# EAGLE design Z80-Clock-And-Reset-1-1 (EAGLE 9.6.2)
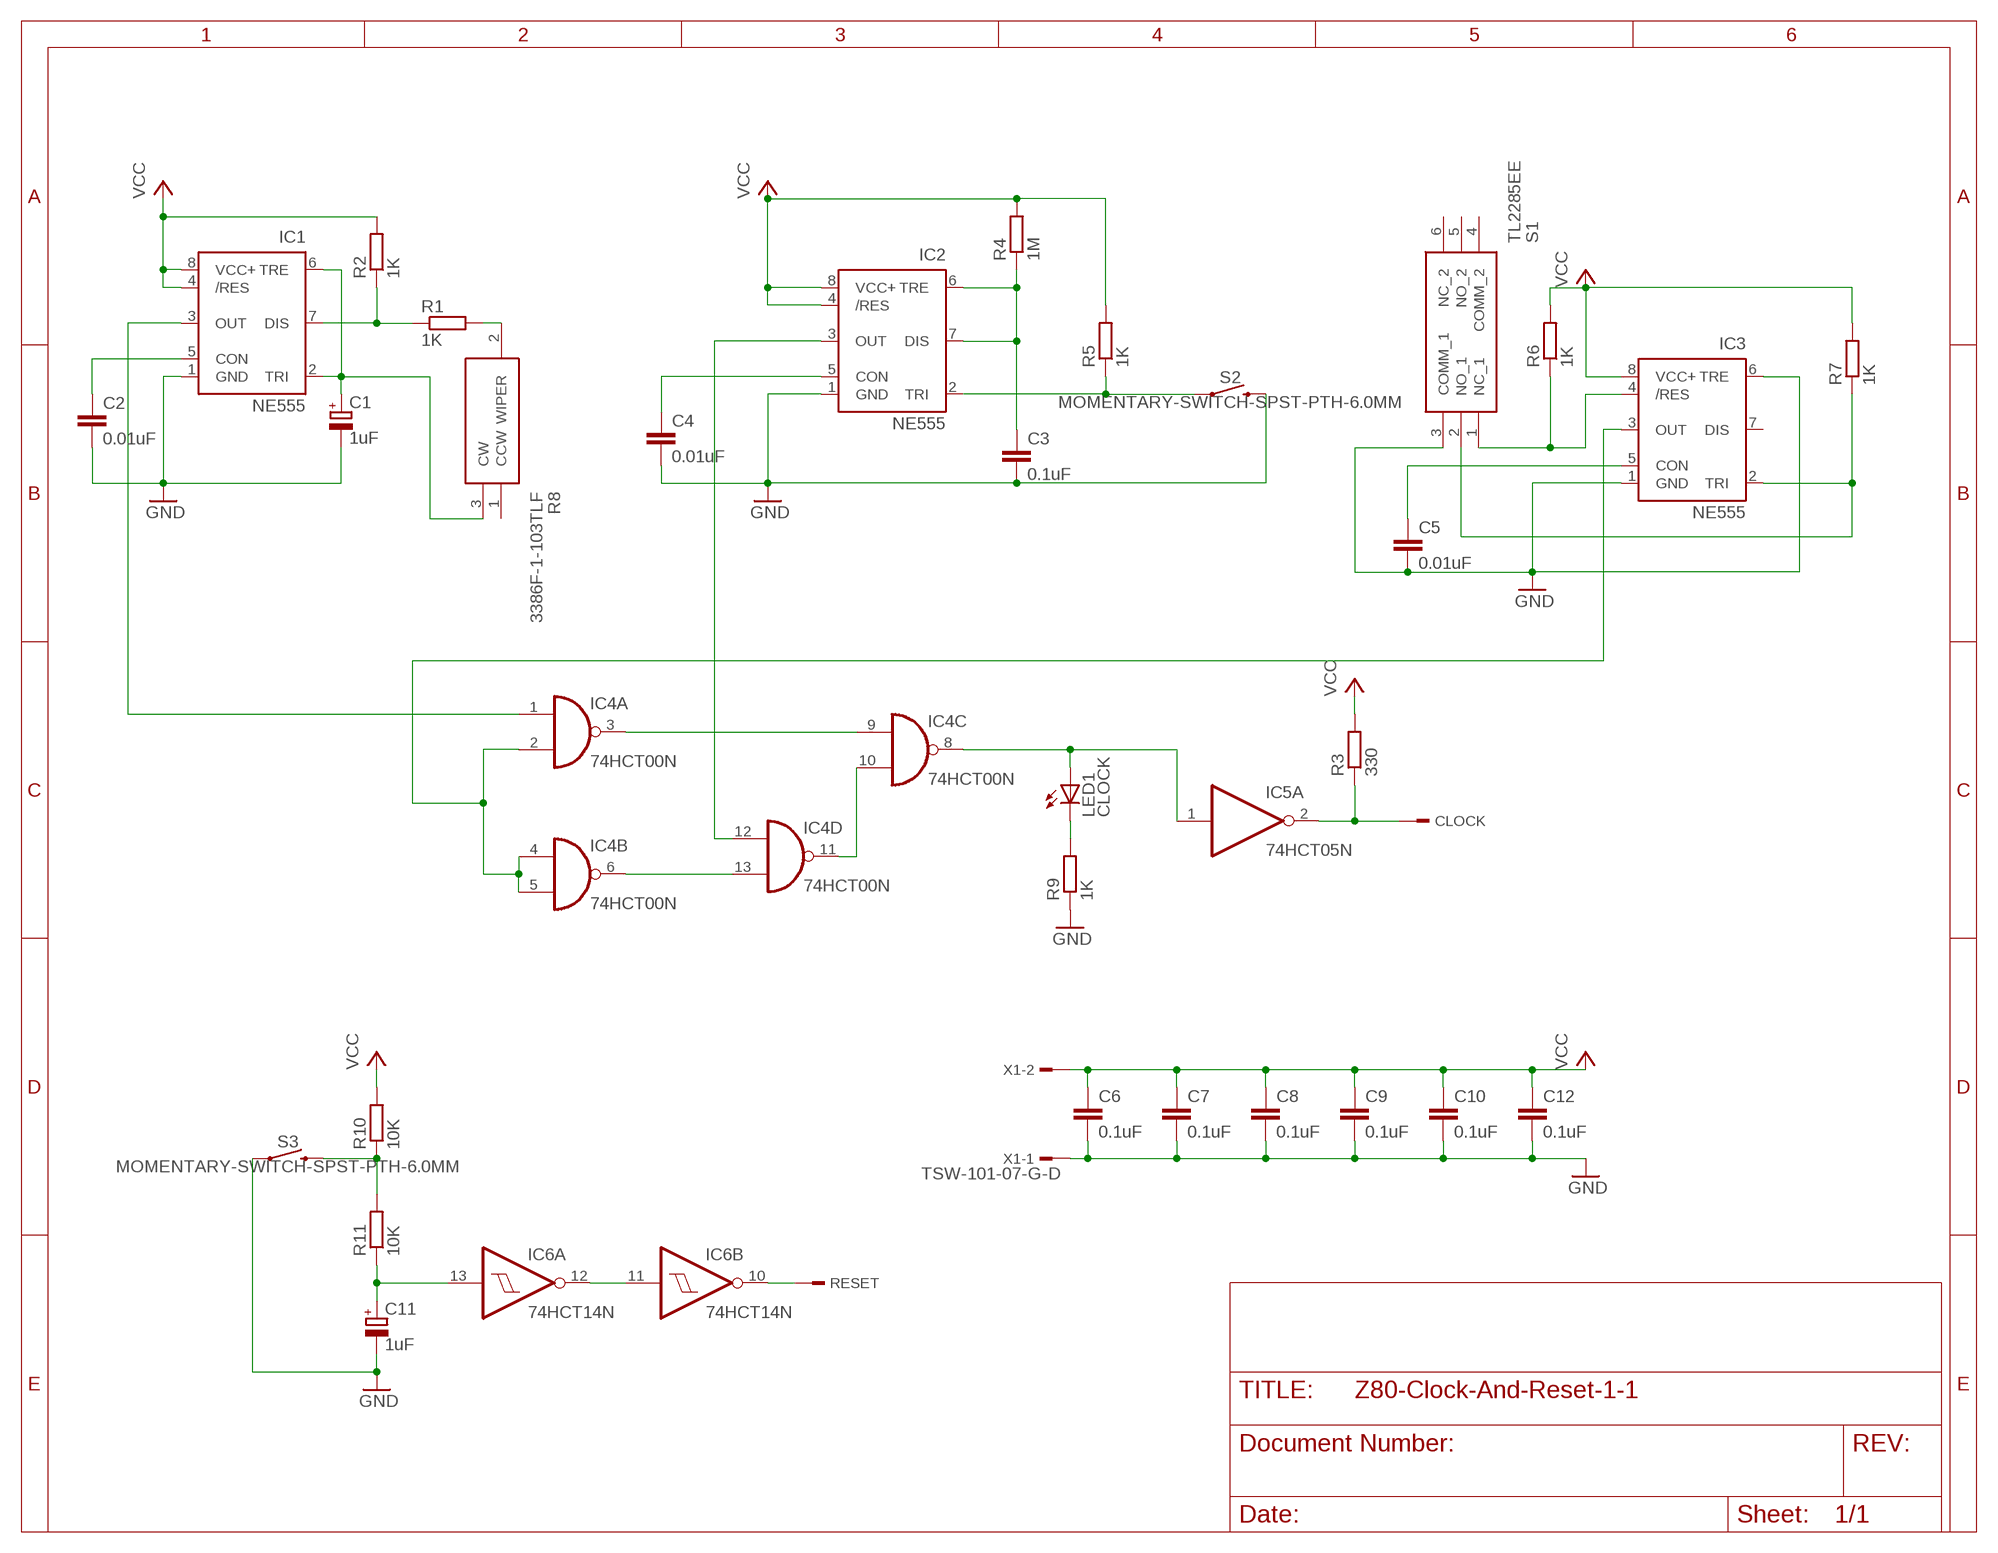
[diagram p0: schematic, sheet 1]

## Parts
C1  1uF  CPOL-EUE2,5-6E  [E2,5-6E]
C2  0.01uF  C-EU050-025X075  [C050-025X075]
C3  0.1uF  C-EU050-025X075  [C050-025X075]
C4  0.01uF  C-EU050-025X075  [C050-025X075]
C5  0.01uF  C-EU050-025X075  [C050-025X075]
C6  0.1uF  C-EU050-025X075  [C050-025X075]
C7  0.1uF  C-EU050-025X075  [C050-025X075]
C8  0.1uF  C-EU050-025X075  [C050-025X075]
C9  0.1uF  C-EU050-025X075  [C050-025X075]
C10  0.1uF  C-EU050-025X075  [C050-025X075]
C11  1uF  CPOL-EUE2,5-6E  [E2,5-6E]
C12  0.1uF  C-EU050-025X075  [C050-025X075]
CLOCK  TSW-101-07-G-S  [TSW-101-XX-G-S]
IC1  NE555  [DIL-08]
IC2  NE555  [DIL-08]
IC3  NE555  [DIL-08]
IC4  74HCT00N  [DIL14]
IC5  74HCT05N  [DIL14]
IC6  74HCT14N  [DIL14]
LED1  CLOCK  LED3MM  [LED3MM]
R1  1K  R-EU_0207/10  [0207/10]
R2  1K  R-EU_0207/10  [0207/10]
R3  330  R-EU_0207/10  [0207/10]
R4  1M  R-EU_0207/10  [0207/10]
R5  1K  R-EU_0207/10  [0207/10]
R6  1K  R-EU_0207/10  [0207/10]
R7  1K  R-EU_0207/10  [0207/10]
R8  3386F-1-103TLF  [3386F1103TLF]
R9  1K  R-EU_0207/10  [0207/10]
R10  10K  R-EU_0207/10  [0207/10]
R11  10K  R-EU_0207/10  [0207/10]
RESET  TSW-101-07-G-S  [TSW-101-XX-G-S]
S1  TL2285EE  [TL2285EE]
S2  MOMENTARY-SWITCH-SPST-PTH-6.0MM  [TACTILE_SWITCH_PTH_6.0MM]
S3  MOMENTARY-SWITCH-SPST-PTH-6.0MM  [TACTILE_SWITCH_PTH_6.0MM]
X1  TSW-101-07-G-D  [TSW-101-XX-G-D]

## Nets
GND [Supply]: C1.- C2.2 C3.2 C4.2 C5.2 C6.2 C7.2 C8.2 C9.2 C10.2 C11.- C12.2 IC1.1(GND) IC2.1(GND) IC3.1(GND) IC3.6(TRE) R9.1 S1.3(COMM_1) S2.3 S3.1 X1.1
N$1: C2.1 IC1.5(CON)
N$2: C1.+ IC1.2(TRI) IC1.6(TRE) R8.3(CW)
N$3: IC1.7(DIS) R1.1 R2.1
N$4: IC3.4(/RES) R6.1 S1.1(NC_1)
N$5: R1.2 R8.2(WIPER)
N$6: C3.1 IC2.6(TRE) IC2.7(DIS) R4.1
N$7: C4.1 IC2.5(CON)
N$8: IC2.2(TRI) R5.1 S2.1
N$9: IC3.3(OUT) IC4.2(A:I1) IC4.4(B:I0) IC4.5(B:I1)
N$10: IC4.3(A:O) IC4.9(C:I0)
N$11: IC2.3(OUT) IC4.12(D:I0)
N$12: C5.1 IC3.5(CON)
N$13: IC1.3(OUT) IC4.1(A:I0)
N$14: IC4.6(B:O) IC4.13(D:I1)
N$15: IC3.2(TRI) R7.1 S1.2(NO_1)
N$16: IC4.10(C:I1) IC4.11(D:O)
N$17: IC4.8(C:O) IC5.1(A:I) LED1.A
N$18: LED1.K(C) R9.2
N$19: CLOCK.1 IC5.2(A:O) R3.1
N$20: R10.1 R11.2 S3.3
N$21: C11.+ IC6.13(A:I) R11.1
N$22: IC6.11(B:I) IC6.12(A:O)
N$23: IC6.10(B:O) RESET.1
VCC [Supply]: C6.1 C7.1 C8.1 C9.1 C10.1 C12.1 IC1.4(/RES) IC1.8(VCC+) IC2.4(/RES) IC2.8(VCC+) IC3.8(VCC+) R2.2 R3.2 R4.2 R5.2 R6.2 R7.2 R10.2 X1.2
Unconnected: IC3.7(DIS) IC5.3(B:I) IC5.4(B:O) IC5.5(C:I) IC5.6(C:O) IC5.8(D:O) IC5.9(D:I) IC5.10(E:O) IC5.11(E:I) IC5.12(F:O) IC5.13(F:I) IC6.1(D:I) IC6.2(D:O) IC6.3(E:I) IC6.4(E:O) IC6.5(F:I) IC6.6(F:O) IC6.8(C:O) IC6.9(C:I) R8.1(CCW) S1.4(COMM_2) S1.5(NO_2) S1.6(NC_2)

## Power pins joined to a net without a drawn wire
GND: IC4.7(P:GND) IC5.7(P:GND) IC6.7(P:GND)
VCC: IC4.14(P:VCC) IC5.14(P:VCC) IC6.14(P:VCC)

## Library data of the parts
C1 C11 = rcl:CPOL-EU: POLARIZED CAPACITOR, European symbol; SPICEPREFIX: C
C2-C10 C12 = rcl:C-EU: CAPACITOR, European symbol; SPICEPREFIX: C
CLOCK RESET = con-samtec:TSW-101-*-G-S: THROUGH-HOLE .025" SQ POST HEADER Source: Samtec TSW.pdf; MF: Samtec Inc.; MPN: TSW-101-07-G-S
IC1-IC3 = st-microelectronics:NE555: General purpose bipolar Timer; MF: Arrow Electronics; MPN: NE555N; OC_FARNELL: 1467742; OC_NEWARK: 89K1486
IC4 = 74xx-eu:74*00: Quad 2-input NAND gate
IC5 = 74xx-eu:74*05: Hex INVERTER, open collector
IC6 = 74xx-eu:74*14: Hex schmitt trigger INVERTER
LED1 = adafruit:LED: LED OSRAM: - CHIPLED LG R971, LG N971, LY N971, LG Q971, LY Q971, LO R971, LY R971 LH N974, LH R974 LS Q976, LO Q976, LY Q976 LO Q996 - Hyper CHIPLED LW Q18S LB Q993, LB Q99A, LB R99A - SideLED LS A670, LO A670, LY A670, LG A670, LP A670 LB A673, LV A673, LT A673, LW A673 LH A674 LY A675 LS A676, LA A676, LO A676, LY A676, LW A676 LS A679, LY A679, LG A679 - Hyper Micro SIDELED® LS Y876, LA Y876, LO Y876, LY Y876 LT Y87S - SmartLED LW L88C, LW L88S LB L89C, LB L89S, LG L890 LS L89K, LO L89K, LY L89K LS L896, LA L896, LO L896, LY L896 - TOPLED LS T670, LO T670, LY T670, LG T670, LP T670 LSG T670, LSP T670, LSY T670, LOP T670, LYG T670 LG T671, LOG T671, LSG T671 LB T673, LV T673, LT T673, LW T673 LH T674 LS T676, LA T676, LO T676, LY T676, LB T676, LH T676, LSB T676, LW T676 LB T67C, LV T67C, LT T67C, LS T67K, LO T67K, LY T67K, LW E67C LS E67B, LA E67B, LO E67B, LY E67B, LB E67C, LV E67C, LT E67C LW T67C LS T679, LY T679, LG T679 LS T770, LO T770, LY T770, LG T770, LP T770 LB T773, LV T773, LT T773, LW T773 LH T774 LS E675, LA E675, LY E675, LS T675 LS T776, LA T776, LO T776, LY T776, LB T776 LHGB T686 LT T68C, LB T68C - Hyper Mini TOPLED® LB M676 - Mini TOPLED Santana® LG M470 LS M47K, LO M47K, LY M47K Source: http://www.osram.convergy.de/
R1-R7 R9-R11 = rcl:R-EU_: RESISTOR, European symbol; SPICEPREFIX: R
R8 = 3386F-1-103TLF:3386F-1-103TLF: Bourns 3386F Series Through Hole Cermet Trimmer Resistor with Pin Terminations, 10k +/-10% 1/2W +/-100ppm/C Finger Adjust Source: Datasheet <https://componentsearchengine.com/Datasheets/1/3386F-1-103TLF.pdf>; ARROW_PART_NUMBER: 3386F-1-103TLF; ARROW_PRICE-STOCK: https://www.arrow.com/en/products/3386f-1-103tlf/bourns?region=europe; DESCRIPTION: Bourns 3386F Series Through Hole Cermet Trimmer Resistor with Pin Terminations, 10k +/-10% 1/2W +/-100ppm/C Finger Adjust; HEIGHT: 4.83mm; MANUFACTURER_NAME: Bourns; MANUFACTURER_PART_NUMBER: 3386F-1-103TLF; MOUSER_PART_NUMBER: 652-3386F-1-103TLF; MOUSER_PRICE-STOCK: https://www.mouser.co.uk/ProductDetail/Bourns/3386F-1-103TLF?qs=nE0RJHjSZ6XfMI2vt3zUow%3D%3D
S1 = TL2285EE:TL2285EE: Tactile Switches DPDT ALT ACT PC MNT Source: Datasheet <https://componentsearchengine.com/Datasheets/1/TL2285EE.pdf>; DESCRIPTION: Tactile Switches DPDT ALT ACT PC MNT; HEIGHT: 13mm; MANUFACTURER_NAME: E-Switch; MANUFACTURER_PART_NUMBER: TL2285EE; MOUSER_PART_NUMBER: 612-TL2285EE; MOUSER_PRICE-STOCK: https://www.mouser.co.uk/ProductDetail/E-Switch/TL2285EE?qs=7Bi7Dg8SEnxrzf04kzdLHA%3D%3D
S2 S3 = SparkFun-Switches:MOMENTARY-SWITCH-SPST: Momentary Switch (Pushbutton) - SPST Normally-open (NO) SPST momentary switches (buttons, pushbuttons). Variants PTH-12MM - 12mm square, through-hole Momentary Pushbutton Switch - 12mm Square <https://www.sparkfun.com/products/9190> (COM-09190) PTH-6.0MM, PTH-6.0MM-KIT - 6.0mm square, through-hole Mini Pushbutton Switch <https://www.sparkfun.com/products/97> (COM-00097) KIT package intended for soldering kit's - only one side of pads' copper is exposed. PTH-RIGHT-ANGLE-KIT - Right-angle, through-hole Right Angle Tactile Button <https://www.sparkfun.com/products/10791> - Used on SparkFun BigTime Watch Kit <https://www.sparkfun.com/products/11734> SMD-12MM - 12mm square, surface-mount Tactile Button - SMD (12mm) <https://www.sparkfun.com/products/12993> (COM-12993) Used on SparkFun PicoBoard <https://www.sparkfun.com/products/11888> SMD-4.5MM - 4.5mm Square Trackball Switch Used on SparkFun Blackberry Trackballer Breakout <https://www.sparkfun.com/products/13169> SMD-4.6MMX2.8MM - 4.60mm x 2.80mm, surface mount Used on SparkFun Pro Micro - RP2040 <https://www.sparkfun.com/products/17717> SMD-5.2MM, SMD-5.2-REDUNDANT - 5.2mm square, surface-mount Mini Pushbutton Switch - SMD <https://www.sparkfun.com/products/8720> (COM-08720) Used on Arduino Pro Mini <https://www.sparkfun.com/products/11114> REDUNDANT package connects both switch circuits together SMD-6.0X3.5MM - 6.0 x 3.5mm, surface mount Momentary Reset Switch SMD <https://www.sparkfun.com/products/8229> (COM-08229) SMD-6.2MM-TALL - 6.2mm square, surface mount Tactile Button - SMD (6mm) <https://www.sparkfun.com/products/12992> Used on SparkFun Digital Sandbox <https://www.sparkfun.com/products/12651> SMD-RIGHT-ANGLE - Right-angle, surface mount Used on SparkFun Block for Intel® Edison - Arduino <https://www.sparkfun.com/products/13036>; PROD_ID: SWCH-08441; SF_SKU: COM-00097
X1 = con-samtec:TSW-101-*-G: THROUGH-HOLE .025" SQ POST HEADER Source: Samtec TSW.pdf; MF: Samtec Inc.; MPN: TSW-101-07-G-D

## Net classes
0 default: width 0.254 mm, clearance 0.254 mm
1 Supply: width 0.508 mm, clearance 0.508 mm

## Board
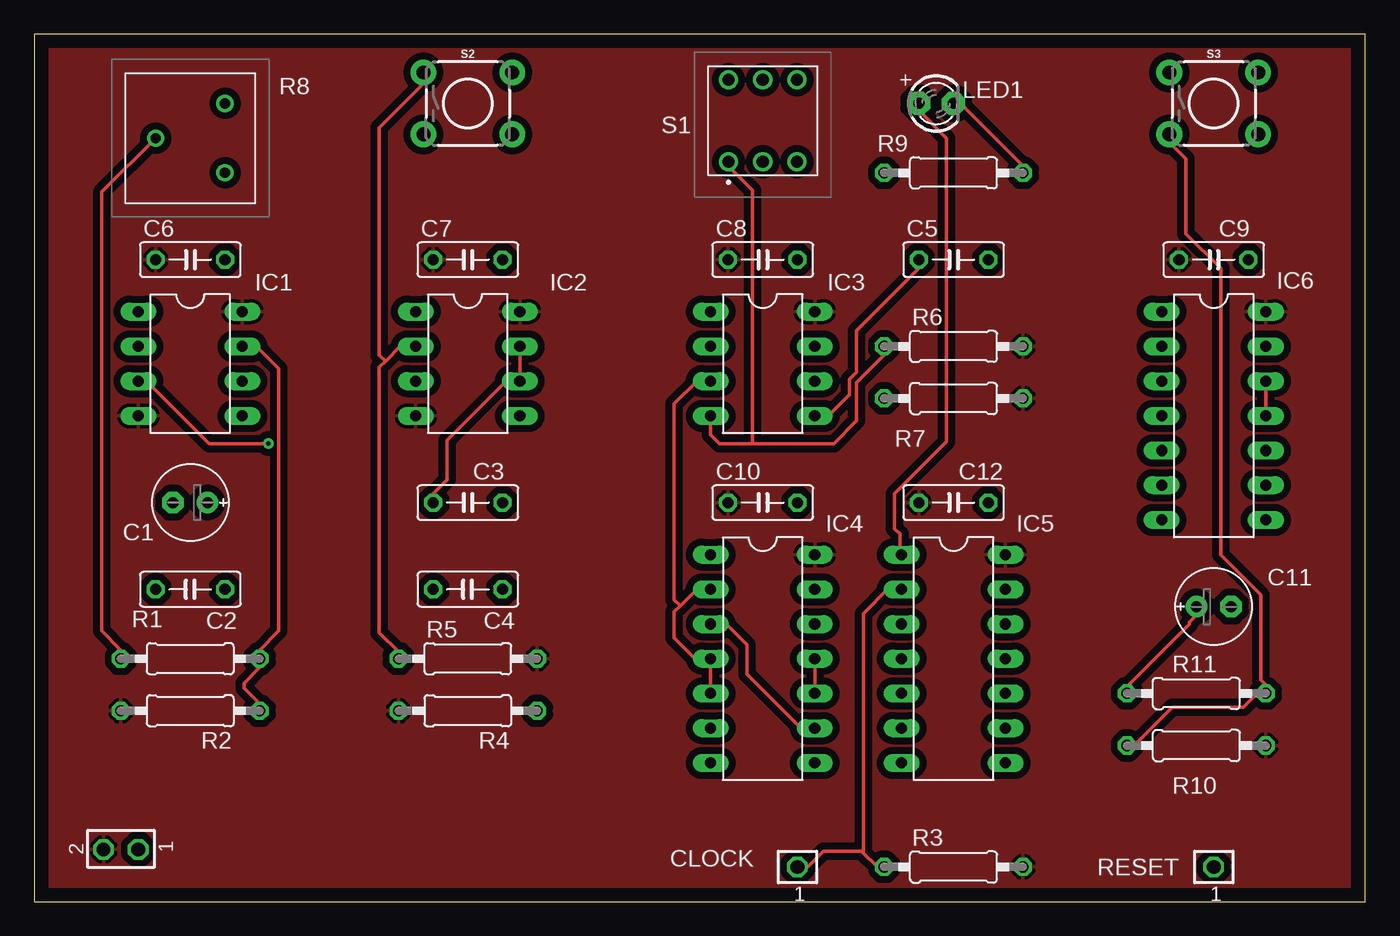
[diagram p1: board, top side]
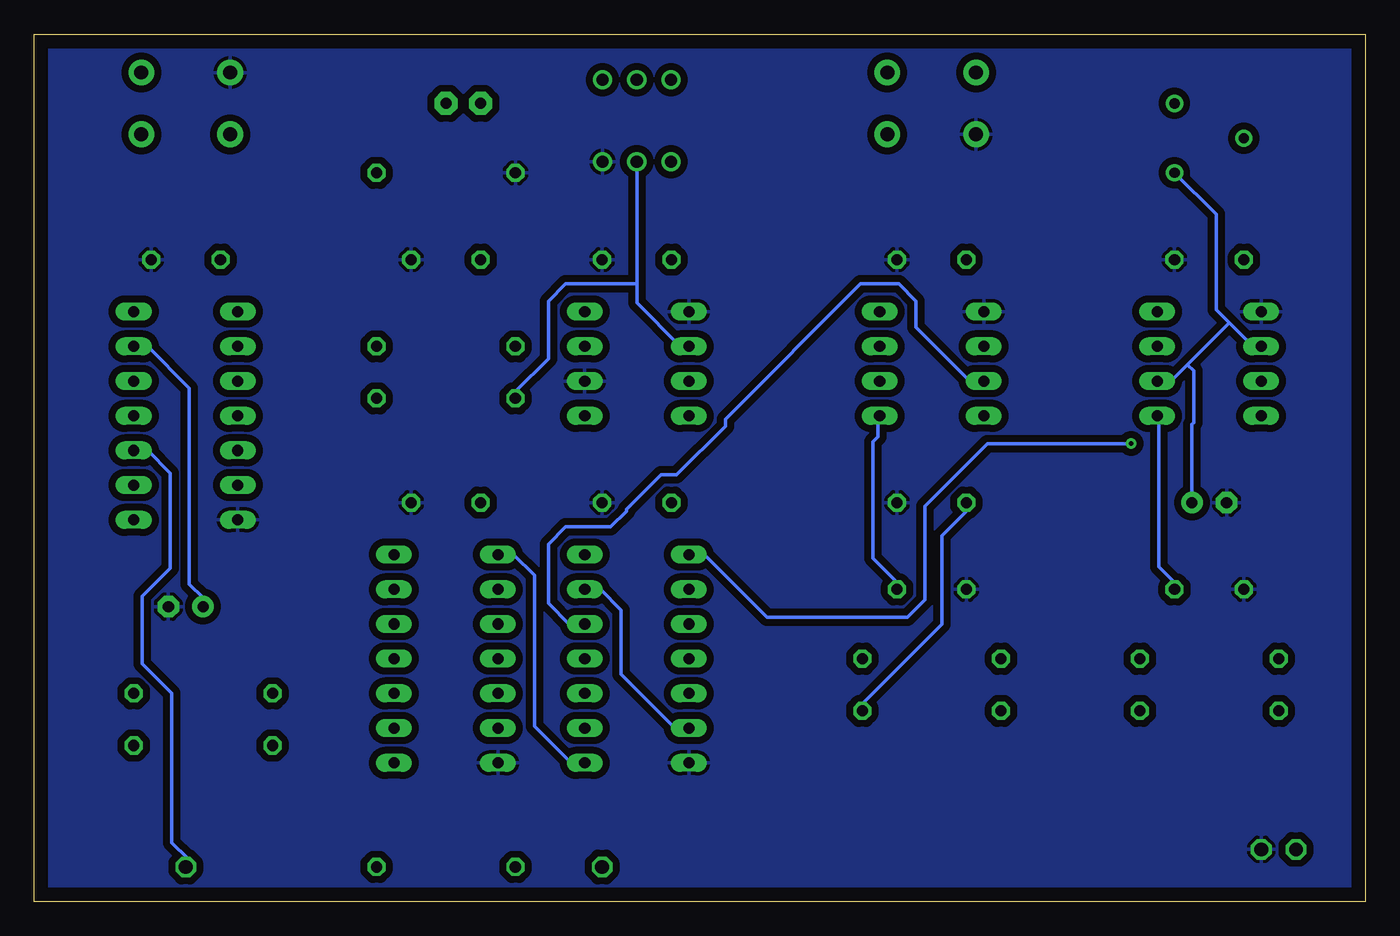
[diagram p2: board, bottom side, seen from below]

Size 97.46 x 63.49 mm. Coordinates in mm from the lower left corner, seen from the top.
Outline: 0,0 97.46,0 97.46,63.49 0,63.49 0,0
Copper layers (1*16): Top 0.035mm / dielectric 1.5mm / Bottom 0.035mm
Design rules "default": minimum track width 6mil, minimum drill 0.35mm, track to track 6mil, track to pad 6mil, pad to pad 6mil, via to via 6mil, smd to smd 6mil, copper to edge 40mil, drill to drill 6mil, minimum pad ring 10mil, minimum via ring 8mil, stop-mask expansion 4mil, vias tented up to drill 0mil, thermal gap 10mil

### Footprints (pad centres in the part's own frame; a part is rotated, then mirrored left to right if it is on the bottom)
E2,5-6E = drill 0.813 pad 1.575: + -1.27,0 | drill 0.813 pad 1.575 octagon: - 1.27,0
C050-025X075 = drill 0.813 octagon: 1 -2.54,0; 2 2.54,0
TSW-101-XX-G-S = drill 1 pad 1.5 octagon: 1 0,0
DIL-08 = drill 0.813 long: 1 -3.81,-3.81; 2 -1.27,-3.81; 3 1.27,-3.81; 4 3.81,-3.81; 5 3.81,3.81; 6 1.27,3.81; 7 -1.27,3.81; 8 -3.81,3.81
DIL14 = drill 0.813 long: 1 -7.62,-3.81; 2 -5.08,-3.81; 3 -2.54,-3.81; 4 0,-3.81; 5 2.54,-3.81; 6 5.08,-3.81; 7 7.62,-3.81; 8 7.62,3.81; 9 5.08,3.81; 10 2.54,3.81; 11 0,3.81; 12 -2.54,3.81; 13 -5.08,3.81; 14 -7.62,3.81
LED3MM = drill 0.813 pad 1.676 octagon: A -1.27,0; K 1.27,0
0207/10 = drill 0.813 octagon: 1 -5.08,0; 2 5.08,0
3386F1103TLF = drill 0.75 pad 1.2: 1 0,0; 2 2.54,-5.08; 3 5.08,0
TL2285EE = drill 0.9 pad 1.4: 1 -2.5,-3; 2 0,-3; 3 2.5,-3; 4 -2.5,3; 5 0,3; 6 2.5,3
TACTILE_SWITCH_PTH_6.0MM = drill 1.016 pad 1.88: 1 -3.251,2.261; 2 3.251,2.261; 3 -3.251,-2.261; 4 3.251,-2.261
TSW-101-XX-G-D = drill 1 pad 1.5 octagon: 1 0.02,-1.27; 2 0.02,1.27

### Placement (x,y rotation side)
C1  11.43,29.21 180 top
C2  11.43,22.86 180 top
C3  31.75,29.21 0 top
C4  31.75,22.86 180 top
C5  67.31,46.99 0 top
C6  11.43,46.99 0 top
C7  31.75,46.99 0 top
C8  53.34,46.99 0 top
C9  86.36,46.99 0 top
C10  53.34,29.21 0 top
C11  86.36,21.59 0 top
C12  67.31,29.21 0 top
CLOCK  55.88,2.54 0 top
IC1  11.43,39.37 270 top
IC2  31.75,39.37 270 top
IC3  53.34,39.37 270 top
IC4  53.34,17.78 270 top
IC5  67.31,17.78 270 top
IC6  86.36,35.56 270 top
LED1  66.04,58.42 0 top
R1  11.43,17.78 180 top
R2  11.43,13.97 180 top
R3  67.31,2.54 0 top
R4  31.75,13.97 180 top
R5  31.75,17.78 0 top
R6  67.31,40.64 0 top
R7  67.31,36.83 0 top
R8  13.97,58.42 270 top
R9  67.31,53.34 0 top
R10  85.09,11.43 0 top
R11  85.09,15.24 0 top
RESET  86.36,2.54 0 top
S1  53.34,57.15 0 top
S2  31.75,58.42 0 top
S3  86.36,58.42 0 top
X1  6.35,3.81 90 top

### Tracks (layer width: path | path; a pad name or v marks a point on that pad's centre or on a via)
GND
  pour Bottom: -2.54,64.77 -2.54,-2.54 100.33,-2.54 100.33,64.77
N$1
  Bottom 0.254: C2.1 13.97,23.37 15.11,24.51 15.11,35.43 IC1.5
N$2
  Bottom 0.254: R8.3 10.92,50.29 10.92,43.31 9.97,42.35 | 9.97,42.35 8.26,40.64 IC1.2 | IC1.6 14.22,38.1 13.02,39.31 | 9.97,42.35 13.02,39.31 | C1.+ 12.7,34.92 12.57,35.05 12.57,38.86 13.02,39.31
N$3
  Top 0.254: R2.1 16.51,14.48 15.37,15.62 15.37,16 16.51,17.14 R1.1 16.51,18.41 17.91,19.81 17.91,38.99 16.26,40.64 IC1.7
N$4
  Top 0.254: IC3.4 49.53,34.16 50.16,33.53 52.58,33.53 | 52.58,33.53 58.55,33.53 60.2,35.18 60.2,37.97 62.23,40.01 R6.1 | 52.58,33.53 52.58,52.07 50.93,53.72 50.93,54.1 S1.1
N$5
  Top 0.254: R8.2 4.95,51.94 4.95,19.81 6.35,18.41 R1.2
N$6
  Top 0.254: IC2.7 IC2.6 34.54,38.1 30.23,33.78 30.23,30.86 29.21,29.84 C3.1
  Bottom 0.254: R4.1 36.83,14.48 30.99,20.32 30.99,26.8 29.21,28.57 C3.1
N$7
  Bottom 0.254: C4.1 34.29,23.37 36.07,25.15 36.07,33.66 35.69,34.04 35.69,35.43 IC2.5
N$8
  Top 0.254: R5.1 26.67,18.29 25.27,19.68 25.27,39.12 25.72,39.56 | 25.72,39.56 26.8,40.64 IC2.2 | 25.72,39.56 25.27,40.01 25.27,56.64 28.45,59.82 28.45,60.58 S2.1
N$9
  Top 0.254: IC4.5 IC4.4 48.39,17.78 46.86,19.3 46.86,21.21 47.31,21.65 | IC4.2 48.51,22.86 47.31,21.65 | IC3.3 48.51,38.1 46.86,36.45 46.86,22.1 47.31,21.65
N$10
  Top 0.254: IC4.9 56.13,12.7 52.2,16.64 52.2,18.8 50.67,20.32 IC4.3
N$11
  Bottom 0.254: IC2.3 28.96,38.1 32.89,42.04 32.89,43.94 34.16,45.21 36.96,45.21 46.86,35.31 46.86,34.8 50.42,31.24 51.56,31.24 54.1,28.7 54.1,28.57 55.24,27.43 58.55,27.43 59.82,26.16 59.82,21.84 58.29,20.32 IC4.12
N$12
  Top 0.254: IC3.5 58.17,35.56 59.69,37.08 59.69,38.23 60.2,38.73 60.2,41.78 64.77,46.35 C5.1
N$13  (via drill 0.35)
  Top 0.254: IC1.3 8.26,38.1 12.83,33.53 v17.14,33.53
  Bottom 0.254: v17.14,33.53 27.69,33.53 32.26,28.96 32.26,22.1 33.53,20.83 43.81,20.83 48.39,25.4 IC4.1
N$14
  Bottom 0.254: IC4.6 50.55,12.7 54.48,16.64 54.48,21.34 56.01,22.86 IC4.13
N$15
  Bottom 0.254: IC3.2 50.16,40.64 53.34,43.81 53.34,45.21 | S1.2 53.34,45.21 | R7.1 62.23,37.34 59.82,39.75 59.82,43.94 58.55,45.21 53.34,45.21
N$16
  Top 0.254: IC4.11 IC4.10
N$17
  Top 0.254: LED1.A 64.77,57.91 66.8,55.88 66.8,33.66 62.99,29.84 62.99,27.3 63.37,26.92 63.37,25.53 IC5.1
  Bottom 0.254: IC4.8 58.17,10.16 60.83,12.83 60.83,23.88 62.36,25.4 IC5.1
N$18
  Top 0.254: R9.2 72.39,53.85 67.69,58.55 67.44,58.55 LED1.K
N$19
  Top 0.254: R3.1 61.72,2.54 60.64,3.62 | 60.64,3.62 60.58,3.68 57.78,3.68 56.52,2.41 56.01,2.41 CLOCK.1 | IC5.2 62.48,22.86 60.71,21.08 60.71,3.68 60.64,3.62
N$20
  Top 0.254: R10.1 80.52,11.43 83.31,14.22 88.52,14.22 89.53,15.24 R11.2 90.17,15.88 89.79,16.26 89.79,22.48 86.87,25.4 86.87,46.35 84.33,48.9 84.33,54.36 83.19,55.5 83.19,56.13 S3.3
N$21
  Top 0.254: R11.1 80.01,15.75 84.58,20.32 84.58,20.45 85.09,20.95 C11.+
  Bottom 0.254: IC6.13 89.15,40.64 86.11,37.59 86.11,23.24 85.09,22.23 C11.+
N$22
  Top 0.254: IC6.12 IC6.11
N$23
  Bottom 0.254: IC6.10 89.15,33.02 87.5,31.37 87.5,24.38 89.53,22.35 89.53,17.4 87.38,15.24 87.38,4.32 86.23,3.17 86.23,2.67 RESET.1
VCC
  pour Top: -2.54,64.77 -2.54,-2.54 100.33,-2.54 101.6,-1.27 101.6,64.77